# Altium schematic sheet MOS_DRIVER.SchDoc
size A4; SheetNumber: 6; SheetTotal: 6
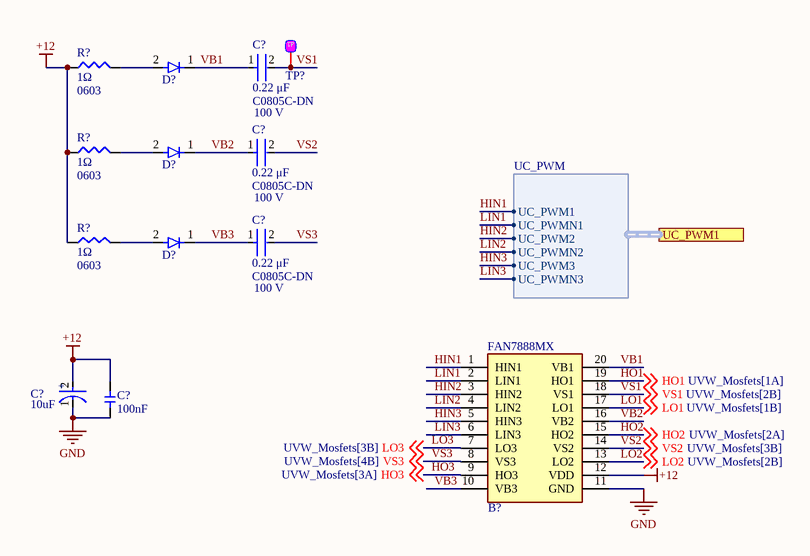
[diagram p0: MOS_DRIVER.SchDoc]

## Parts
(Parts that share a designator on the sheet are numbered #1, #2 ... from top to bottom, then left to right.)
B?  FAN7888MX  [SOIC127P1032X265-20N]
C?#1  value 0.22 μF  Voltage Rating: 100 V  Package: C0805C-DN  [FP-C0805C-DN-IPC_A]  (hidden comment: C0805C224K1RACTU)
C?#2  value 0.22 μF  Voltage Rating: 100 V  Package: C0805C-DN  [FP-C0805C-DN-IPC_A]  (hidden comment: C0805C224K1RACTU)
C?#3  value 0.22 μF  Voltage Rating: 100 V  Package: C0805C-DN  [FP-C0805C-DN-IPC_A]  (hidden comment: C0805C224K1RACTU)
C?#4  Capacitance: 10uF  [FP-SC-MFG]  (hidden comment: EEE1VA100SR)
C?#5  value 100nF  [0603_cap]  (hidden comment: 0603_100nF)
D?#1  DSS110U  [SODFL3618X110N]  (value not drawn)
D?#2  DSS110U  [SODFL3618X110N]  (value not drawn)
D?#3  DSS110U  [SODFL3618X110N]  (value not drawn)
R?#1  value 1Ω  Package: 0603  [0603-smd]  (hidden comment: 0603_1R)
R?#2  value 1Ω  Package: 0603  [0603-smd]  (hidden comment: 0603_1R)
R?#3  value 1Ω  Package: 0603  [0603-smd]  (hidden comment: 0603_1R)
TP?  Test Point  [test_point]  (value not drawn)

## Ports
UC_PWM1 (harness UC_PWM)

## Harnesses
UC_PWM: UC_PWM1, UC_PWM2, UC_PWM3, UC_PWMN1, UC_PWMN2, UC_PWMN3

## Nets
+12: B?.12(VDD) C?#4.2(A) C?#5.2 R?#1.1 R?#2.1 R?#3.1
GND: B?.11(GND) C?#4.1(C) C?#5.1
HIN1: B?.1(HIN1) ; port UC_PWM1.UC_PWM1
HIN2: B?.3(HIN2) ; port UC_PWM1.UC_PWM2
HIN3: B?.5(HIN3) ; port UC_PWM1.UC_PWM3
HO1: B?.19(HO1) ; off-sheet HO1
HO2: B?.15(HO2) ; off-sheet HO2
HO3: B?.9(HO3) ; off-sheet HO3
LIN1: B?.2(LIN1) ; port UC_PWM1.UC_PWMN1
LIN2: B?.4(LIN2) ; port UC_PWM1.UC_PWMN2
LIN3: B?.6(LIN3) ; port UC_PWM1.UC_PWMN3
LO1: B?.17(LO1) ; off-sheet LO1
LO2: B?.13(LO2) ; off-sheet LO2
LO3: B?.7(LO3) ; off-sheet LO3
VB1: B?.20(VB1) C?#1.1 D?#1.1
VB2: B?.16(VB2) C?#2.1 D?#2.1
VB3: B?.10(VB3) C?#3.1 D?#3.1
VS1: B?.18(VS1) C?#1.2 TP?.1 ; off-sheet VS1
VS2: B?.14(VS2) C?#2.2 ; off-sheet VS2
VS3: B?.8(VS3) C?#3.2 ; off-sheet VS3
NetD?#1_2: D?#1.2 R?#1.2
NetD?#2_2: D?#2.2 R?#2.2
NetD?#3_2: D?#3.2 R?#3.2

## Notes on the sheet
- (in symbol CMP-05427-000087-1) +

## Library data of the parts
B? = FAN7888MX: IC, Fairchild, FAN7888MX Fairchild Semiconductor FAN7888MX, Triple MOSFET Power Driver 350 mA, 650 mA Half Bridge, 10  20 V, Inverting; Manufacturer_Name: onsemi; Geometry.Height: 2.65mm; Manufacturer_Part_Number: FAN7888MX; Mouser Part Number: 512-FAN7888MX; Mouser Price/Stock: https://www.mouser.com/Search/Refine.aspx?Keyword=512-FAN7888MX; Arrow Part Number: FAN7888MX; Arrow Price/Stock: https://www.arrow.com/en/products/fan7888mx/on-semiconductor?region=nac; Datasheet Link: https://datasheet.datasheetarchive.com/originals/distributors/Datasheets_SAMA/c3972c1f85deead54c211aade99f8627.pdf; Supplier 1: Arrow Electronics; Supplier Part Number 1: FAN7888MX
C?#1-C?#3 = CMP-2007-03262-2: CAP CER 0.22UF 100V 10% X7R 0805; Manufacturer: KEMET; Material: Ceramic; Tolerance: 0.1; Temperature Coefficient: 30ppm/°C; Temperature Range High: +125°C; Temperature Range Low: -55°C; Device Class L2: Capacitors; Manufacturer Part Number: C0805C224K1RACTU; Octopart: https://octopart.com/c0805c224k1ractu-kemet-12818106; ComponentLink2URL: https://content.kemet.com/datasheets/KEM_C1003_C0G_SMD.pdf; RoHS: TRUE; Temperature: -55°C to +125°C; Ipc Land Pattern Name: CAPC200125X78; Category: Cap; ComponentLink2Description: Datasheet; Height: 0.88mm; Device Class L1: Passive Components; Digikey Description: CAP CER 0.22UF 100V 10% X7R 0805; Mouser Description: 0805 C 220nF Ceramic Multilayer Capacitor, 100 V, +125degC, X7R Dielec, +/-10%; Capacitance: 0.22 μF; Lead Free: Yes; Automotive: No; Temperature Characteristic: X7R; Device Class L3: Ceramic Capacitors
C?#4 = CMP-05427-000087-1: CAP ALUM 10UF 20% 35V SMD; Life (Hours): 2000Hour; Lead Length: 2.2mm; Ripple Current (AC): 30mA; Leakage Current: 3uA; Length: 5.5mm; Construction: Cylindrical; Diameter: 5mm; RoHS Compliant: Yes; REACH SVHC: No SVHC; Max Operating Temperature: 85°C; Series: S; Case/Package: Radial; Contact Plating: Tin; Packaging: Tape and Reel; Voltage Rating: 35V; Number of Pins: 2; Height: 5.4mm; Width: 5.3mm; Voltage Rating (DC): 35V; Mount: Surface Mount; Tolerance: 20%; Lead Pitch: 1.5mm; Radiation Hardening: No; Height - Seated (Max): 0.213inch; Ripple Current: 30mA; Voltage: 35V; Package Quantity: 1; Termination: SMD/SMT; Min Operating Temperature: -40°C
C?#5 = 0603_100nF: Volt: V; Package: 0603
D?#1-D?#3 = SOD-123FL: Diode 100 V 1A Surface Mount SOD-123FL; ComponentLink1Description: New link; ComponentLink1URL: *; Supplier 1: Future Electronics; Supplier Part Number 1: 6125592
R?#1-R?#3 = 0603_1R: Power: W
TP? = TP